# EAGLE design ASBS_radio_v1_1 (EAGLE 5.11)
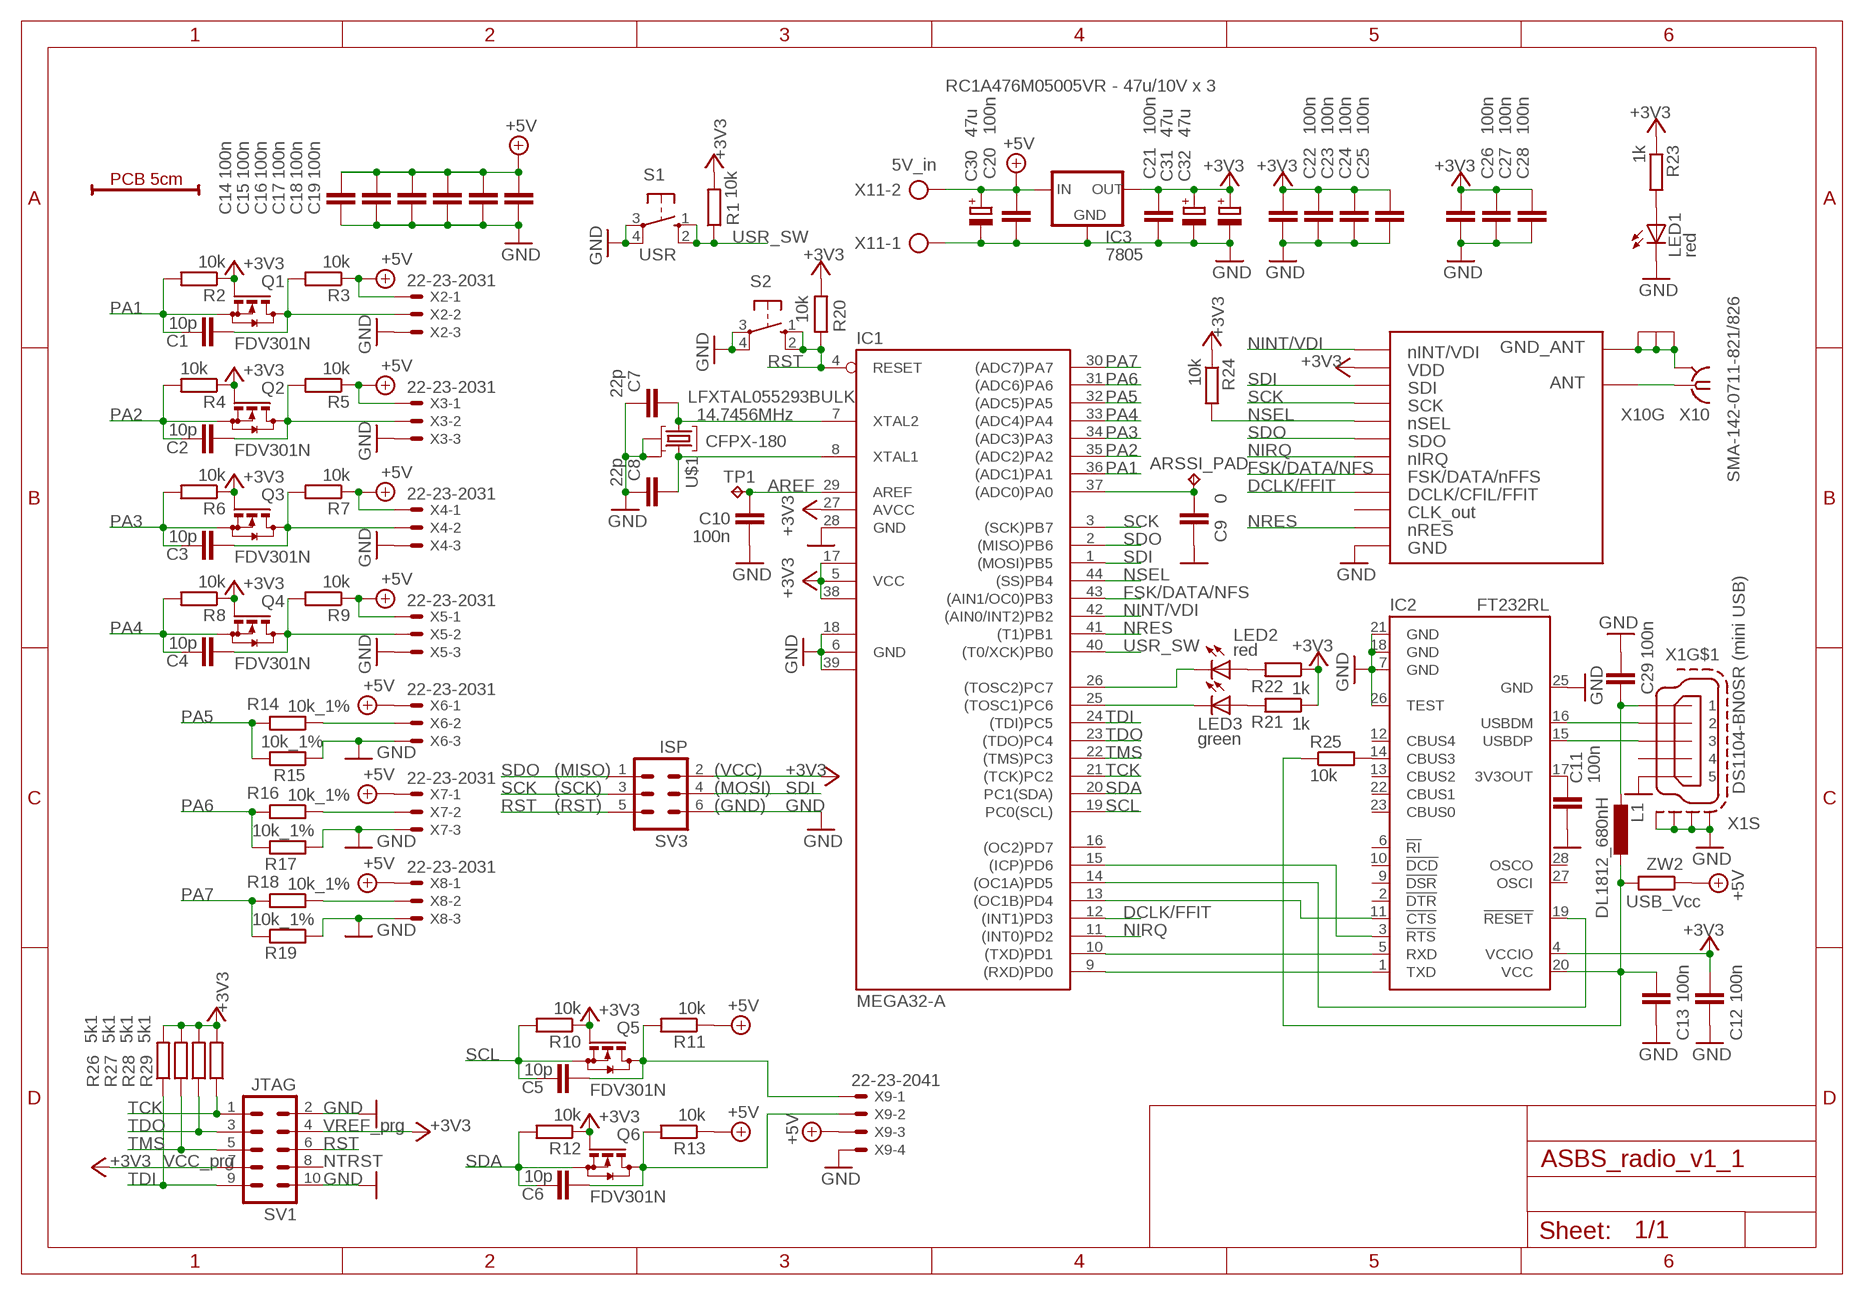
[diagram p0: schematic, sheet 1]

## Parts
ARSSI_PAD  TPPAD1-13  [P1-13]
C1  10p  C-EUC0603K  [C0603K]
C2  10p  C-EUC0603K  [C0603K]
C3  10p  C-EUC0603K  [C0603K]
C4  10p  C-EUC0603K  [C0603K]
C5  10p  C-EUC0603K  [C0603K]
C6  10p  C-EUC0603K  [C0603K]
C7  22p  C-EUC0603K  [C0603K]
C8  22p  C-EUC0603K  [C0603K]
C9  0  C-EUC0805  [C0805]
C10  100n  C-EUC0805  [C0805]
C11  100n  C-EUC0805  [C0805]
C12  100n  C-EUC0805  [C0805]
C13  100n  C-EUC0805  [C0805]
C14  100n  C-EUC0805  [C0805]
C15  100n  C-EUC0805  [C0805]
C16  100n  C-EUC0805  [C0805]
C17  100n  C-EUC0805  [C0805]
C18  100n  C-EUC0805  [C0805]
C19  100n  C-EUC0805  [C0805]
C20  100n  C-EUC0805  [C0805]
C21  100n  C-EUC0805  [C0805]
C22  100n  C-EUC0805  [C0805]
C23  100n  C-EUC0805  [C0805]
C24  100n  C-EUC0805  [C0805]
C25  100n  C-EUC0805  [C0805]
C26  100n  C-EUC0805  [C0805]
C27  100n  C-EUC0805  [C0805]
C28  100n  C-EUC0805  [C0805]
C29  100n  C-EUC0805  [C0805]
C30  47u  CPOL-EU153CLV-0505  [153CLV-0505]
C31  47u  CPOL-EU153CLV-0505  [153CLV-0505]
C32  47u  CPOL-EU153CLV-0505  [153CLV-0505]
IC1  MEGA32-A  [TQFP44]
IC2  FT232RL  [SSOP28]
IC3  7805  78XXS  [78XXS]
L1  DL1812_680nH  L-EUL4516C  [L4516C]
LED1  red  LEDCHIP-LED0805  [CHIP-LED0805]
LED2  red  LEDCHIP-LED0805  [CHIP-LED0805]
LED3  green  LEDCHIP-LED0805  [CHIP-LED0805]
Q1  FDV301N  BSS123  [SOT23]
Q2  FDV301N  BSS123  [SOT23]
Q3  FDV301N  BSS123  [SOT23]
Q4  FDV301N  BSS123  [SOT23]
Q5  FDV301N  BSS123  [SOT23]
Q6  FDV301N  BSS123  [SOT23]
R1  10k  R-EU_R0603  [R0603]
R2  10k  R-EU_R0603  [R0603]
R3  10k  R-EU_R0603  [R0603]
R4  10k  R-EU_R0603  [R0603]
R5  10k  R-EU_R0603  [R0603]
R6  10k  R-EU_R0603  [R0603]
R7  10k  R-EU_R0603  [R0603]
R8  10k  R-EU_R0603  [R0603]
R9  10k  R-EU_R0603  [R0603]
R10  10k  R-EU_R0603  [R0603]
R11  10k  R-EU_R0603  [R0603]
R12  10k  R-EU_R0603  [R0603]
R13  10k  R-EU_R0603  [R0603]
R14  10k_1%  R-EU_R0603  [R0603]
R15  10k_1%  R-EU_R0603  [R0603]
R16  10k_1%  R-EU_R0603  [R0603]
R17  10k_1%  R-EU_R0603  [R0603]
R18  10k_1%  R-EU_R0603  [R0603]
R19  10k_1%  R-EU_R0603  [R0603]
R20  10k  R-EU_R0603  [R0603]
R21  1k  R-EU_R0603  [R0603]
R22  1k  R-EU_R0603  [R0603]
R23  1k  R-EU_R0603  [R0603]
R24  10k  R-EU_R0603  [R0603]
R25  10k  R-EU_R0603  [R0603]
R26  5k1  R-EU_R0603  [R0603]
R27  5k1  R-EU_R0603  [R0603]
R28  5k1  R-EU_R0603  [R0603]
R29  5k1  R-EU_R0603  [R0603]
S1  USR  10-XX  [B3F-10XX]
S2  RST  10-XX  [B3F-10XX]
SV1  JTAG  MA05-2  [MA05-2]
SV3  ISP  MA03-2  [MA03-2]
TP1  TPPAD1-13  [P1-13]
U$1  CFPX-180  [CFPX-180]
U$2  RFM12BS  [RFM12B_RF_SMD]
U$3  SCALE_5CM  [SCALE_5CM]
X1  DS1104-BN0SR (mini USB)  MINI-USB-SCHIELD-32005-201  [32005-201]
X2  22-23-2031  [22-23-2031]
X3  22-23-2031  [22-23-2031]
X4  22-23-2031  [22-23-2031]
X5  22-23-2031  [22-23-2031]
X6  22-23-2031  [22-23-2031]
X7  22-23-2031  [22-23-2031]
X8  22-23-2031  [22-23-2031]
X9  22-23-2041  [22-23-2041]
X10  SMA-142-0711-821/826  [J502-ND-142-0711-821/826]
X11  5V_in  AK500/2  [AK500/2]
ZW2  USB_Vcc  R-EU_R0603  [R0603]

## Nets
+3V3: C12.2 C21.1 C22.1 C23.1 C24.1 C25.1 C26.1 C27.1 C28.1 C31.+ C32.+ IC1.5(VCC) IC1.17(VCC1) IC1.27(AVCC) IC1.38(VCC2) IC2.4(VCCIO) IC3.OUT Q1.1(G) Q2.1(G) Q3.1(G) Q4.1(G) Q5.1(G) Q6.1(G) R1.2 R2.1 R4.1 R6.1 R8.1 R10.1 R12.1 R20.2 R21.1 R22.1 R23.1 R24.1 R26.2 R27.2 R28.2 R29.2 SV1.4 SV1.7 SV3.2 U$2.P$2
+5V: C14.1 C15.1 C16.1 C17.1 C18.1 C19.1 C20.1 C30.+ IC3.IN R3.1 R5.1 R7.1 R9.1 R11.1 R13.1 X2.1 X3.1 X4.1 X5.1 X6.1 X7.1 X8.1 X9.3 X11.2 ZW2.1
AREF: C10.2 IC1.29(AREF) TP1.TP
ARSSI: ARSSI_PAD.TP C9.2 IC1.37((ADC0)PA0)
DCLK/FFIT: IC1.12((INT1)PD3) U$2.P$9
FSK/DATA/NFS: IC1.43((AIN1/OC0)PB3) U$2.P$8
GND: C7.1 C8.1 C9.1 C10.1 C11.2 C12.1 C13.1 C14.2 C15.2 C16.2 C17.2 C18.2 C19.2 C20.2 C21.2 C22.2 C23.2 C24.2 C25.2 C26.2 C27.2 C28.2 C29.1 C30.- C31.- C32.- IC1.6(GND) IC1.18(GND1) IC1.28(GND) IC1.39(GND2) IC2.7(GND) IC2.18(GND) IC2.21(GND) IC2.25(GND) IC2.26(TEST) IC3.GND LED1.C R15.1 R17.1 R19.1 S1.3(P) S1.4(P1) S2.3(P) S2.4(P1) SV1.2 SV1.10 SV3.6 U$1.P$2 U$1.P$4 U$2.P$12 X1.5 X1.M1(S:S1) X1.M2(S:S2) X1.M3(S:S3) X1.M4(S:S4) X2.3 X3.3 X4.3 X5.3 X6.3 X7.3 X8.3 X9.4 X11.1
N$1: IC1.13((OC1B)PD4) IC2.11(!CTS)
N$2: IC1.14((OC1A)PD5) IC2.19(!RESET)
N$3: IC1.15((ICP)PD6) IC2.3(!RTS)
N$4: C2.2 Q2.3(D) R5.2 X3.2
N$5: C8.2 IC1.8(XTAL1) U$1.P$3
N$6: C7.2 IC1.7(XTAL2) U$1.P$1
N$7: IC2.14(CBUS3) R25.2
N$8: C3.2 Q3.3(D) R7.2 X4.2
N$9: C1.2 Q1.3(D) R3.2 X2.2
N$10: C4.2 Q4.3(D) R9.2 X5.2
N$11: U$2.P$13 X10.1
N$12: R14.1 X6.2
N$13: R16.1 X7.2
N$14: IC1.26((TOSC2)PC7) LED2.C
N$15: IC1.9((RXD)PD0) IC2.1(TXD)
N$16: IC1.10((TXD)PD1) IC2.5(RXD)
N$17: IC1.25((TOSC1)PC6) LED3.C
N$18: LED3.A R21.2
N$19: LED2.A R22.2
N$20: R18.1 X8.2
N$21: LED1.A R23.2
N$22: C5.2 Q5.3(D) R11.2 X9.1
N$23: C6.2 Q6.3(D) R13.2 X9.2
N$39: C13.2 IC2.20(VCC) L1.1 R25.1 ZW2.2
N$43: C29.2 L1.2 X1.1
N$44: IC2.16(USBDM) X1.2
N$45: IC2.15(USBDP) X1.3
N$46: C11.1 IC2.17(3V3OUT)
NINT/VDI: IC1.42((AIN0/INT2)PB2) U$2.P$1
NIRQ: IC1.11((INT0)PD2) U$2.P$7
NRES: IC1.41((T1)PB1) U$2.P$11
NSEL: IC1.44((SS)PB4) R24.2 U$2.P$5
PA1: C1.1 IC1.36((ADC1)PA1) Q1.2(S) R2.2
PA2: C2.1 IC1.35((ADC2)PA2) Q2.2(S) R4.2
PA3: C3.1 IC1.34((ADC3)PA3) Q3.2(S) R6.2
PA4: C4.1 IC1.33((ADC4)PA4) Q4.2(S) R8.2
PA5: IC1.32((ADC5)PA5) R14.2 R15.2
PA6: IC1.31((ADC6)PA6) R16.2 R17.2
PA7: IC1.30((ADC7)PA7) R18.2 R19.2
RGND: U$2.P$14 X10.G@1(GND) X10.G@2(GND) X10.G@3(GND) X10.G@4(GND)
RST: IC1.4(RESET) R20.1 S2.1(S) S2.2(S1) SV1.6 SV3.5
SCK: IC1.3((SCK)PB7) SV3.3 U$2.P$4
SCL: C5.1 IC1.19(PC0(SCL)) Q5.2(S) R10.2
SDA: C6.1 IC1.20(PC1(SDA)) Q6.2(S) R12.2
SDI: IC1.1((MOSI)PB5) SV3.4 U$2.P$3
SDO: IC1.2((MISO)PB6) SV3.1 U$2.P$6
TCK: IC1.21((TCK)PC2) R29.1 SV1.1
TDI: IC1.24((TDI)PC5) R26.1 SV1.9
TDO: IC1.23((TDO)PC4) R28.1 SV1.3
TMS: IC1.22((TMS)PC3) R27.1 SV1.5
USR_SW: IC1.40((T0/XCK)PB0) R1.1 S1.1(S) S1.2(S1)
Unconnected: IC1.16((OC2)PD7) IC2.2(!DTR) IC2.6(!RI) IC2.9(!DSR) IC2.10(!DCD) IC2.12(CBUS4) IC2.13(CBUS2) IC2.22(CBUS1) IC2.23(CBUS0) IC2.27(OSCI) IC2.28(OSCO) SV1.8 U$2.P$10 X1.4

## Notes on the sheet
- RC1A476M05005VR - 47u/10V x 3
- LFXTAL055293BULK
- 14.7456MHz
- (MISO) | (VCC)
- (SCK) | (MOSI)
- (RST) | (GND)
- GND
- VREF_prg
- VCC_prg | NTRST
- GND

## Library data of the parts
ARSSI_PAD TP1 = testpad:TP: Test pad
C1-C6 C9-C29 = rcl:C-EU: CAPACITOR, European symbol
C7 C8 = resistor:C-EU: CAPACITOR, European symbol
C30-C32 = rcl:CPOL-EU: POLARIZED CAPACITOR, European symbol
IC1 = atmel:MEGA32: MICROCONTROLLER 32 Kbytes FLASH 2 Kbytes SRAM 1 Kbytes EEPROM USART 8-channel 10 bit ADC Source: www.atmel.com .. doc2503.pdf; MPN: ATMEGA32-16AU; OC_FARNELL: 9171274; OC_NEWARK: 69K6677
IC2 = ftdichip:FT232R: Source: http://www.ftdichip.com/Documents/DataSheets/DS_FT232R_v104.pdf; MPN: FT232RL; OC_FARNELL: 1146032; OC_NEWARK: 91K9918
IC3 = v-reg:78XXS: VOLTAGE REGULATOR
L1 = rcl:L-EU: INDUCTOR, European symbol
LED1-LED3 = led:LED: LED OSRAM: - CHIPLED LG R971, LG N971, LY N971, LG Q971, LY Q971, LO R971, LY R971 LH N974, LH R974 LS Q976, LO Q976, LY Q976 LO Q996 - Hyper CHIPLED LW Q18S LB Q993, LB Q99A, LB R99A - SideLED LS A670, LO A670, LY A670, LG A670, LP A670 LB A673, LV A673, LT A673, LW A673 LH A674 LY A675 LS A676, LA A676, LO A676, LY A676, LW A676 LS A679, LY A679, LG A679 - Hyper Micro SIDELED® LS Y876, LA Y876, LO Y876, LY Y876 LT Y87S - SmartLED LW L88C, LW L88S LB L89C, LB L89S, LG L890 LS L89K, LO L89K, LY L89K LS L896, LA L896, LO L896, LY L896 - TOPLED LS T670, LO T670, LY T670, LG T670, LP T670 LSG T670, LSP T670, LSY T670, LOP T670, LYG T670 LG T671, LOG T671, LSG T671 LB T673, LV T673, LT T673, LW T673 LH T674 LS T676, LA T676, LO T676, LY T676, LB T676, LH T676, LSB T676, LW T676 LB T67C, LV T67C, LT T67C, LS T67K, LO T67K, LY T67K, LW E67C LS E67B, LA E67B, LO E67B, LY E67B, LB E67C, LV E67C, LT E67C LW T67C LS T679, LY T679, LG T679 LS T770, LO T770, LY T770, LG T770, LP T770 LB T773, LV T773, LT T773, LW T773 LH T774 LS E675, LA E675, LY E675, LS T675 LS T776, LA T776, LO T776, LY T776, LB T776 LHGB T686 LT T68C, LB T68C - Hyper Mini TOPLED® LB M676 - Mini TOPLED Santana® LG M470 LS M47K, LO M47K, LY M47K Source: http://www.osram.convergy.de LUXEON: - LUMILED® LXK2-PW12-R00, LXK2-PW12-S00, LXK2-PW14-U00, LXK2-PW14-V00 LXK2-PM12-R00, LXK2-PM12-S00, LXK2-PM14-U00 LXK2-PE12-Q00, LXK2-PE12-R00, LXK2-PE12-S00, LXK2-PE14-T00, LXK2-PE14-U00 LXK2-PB12-K00, LXK2-PB12-L00, LXK2-PB12-M00, LXK2-PB14-N00, LXK2-PB14-P00, LXK2-PB14-Q00 LXK2-PR12-L00, LXK2-PR12-M00, LXK2-PR14-Q00, LXK2-PR14-R00 LXK2-PD12-Q00, LXK2-PD12-R00, LXK2-PD12-S00 LXK2-PH12-R00, LXK2-PH12-S00 LXK2-PL12-P00, LXK2-PL12-Q00, LXK2-PL12-R00 Source: www.luxeon.com KINGBRIGHT: KA-3528ASYC Source: www.kingbright.com
Q1-Q6 = transistor-small-signal:BSS123: N-CHANNEL MOS FET
R1-R29 ZW2 = resistor:R-EU_: RESISTOR, European symbol
S1 S2 = switch-omron:10-XX: OMRON SWITCH; MPN: B3F-1000; OC_FARNELL: 176432; OC_NEWARK: 36M3542
SV1 = con-lstb:MA05-2: PIN HEADER; OC_FARNELL: unknown; OC_NEWARK: unknown
SV3 = con-lstb:MA03-2: PIN HEADER; OC_FARNELL: unknown; OC_NEWARK: unknown
U$1 = crystal_frequency_products:CFPX-180
U$2 = RFM12B:RFM12B
U$3 = scale:SCALE_5CM
X1 = con-cypressindustries:MINI-USB-SCHIELD-: MINI USB-B Conector Source: www.cypressindustries.com; OC_FARNELL: unknown; OC_NEWARK: unknown
X2-X8 = con-molex:22-23-2031: .100" (2.54mm) Center Header - 3 Pin; MF: MOLEX; MPN: 22-23-2031; OC_FARNELL: 1462950; OC_NEWARK: 30C0862
X9 = con-molex:22-23-2041: .100" (2.54mm) Center Header - 4 Pin; MF: MOLEX; MPN: 22-23-2041; OC_FARNELL: 1462920; OC_NEWARK: 38C0355
X10 = con-coax:SMA-: SMA 50 Ohm End Launch Jack Receptacle - Round Contact Johnson Components Source: www.johnsoncomponents.com .. J502-ND.pdf; MF: JOHNSON COMPONENTS; MPN: 142-0711-821; OC_FARNELL: 1019328; OC_NEWARK: 16F3627
X11 = con-ptr500:AK500/2: CONNECTOR; OC_FARNELL: unknown; OC_NEWARK: unknown

## Board
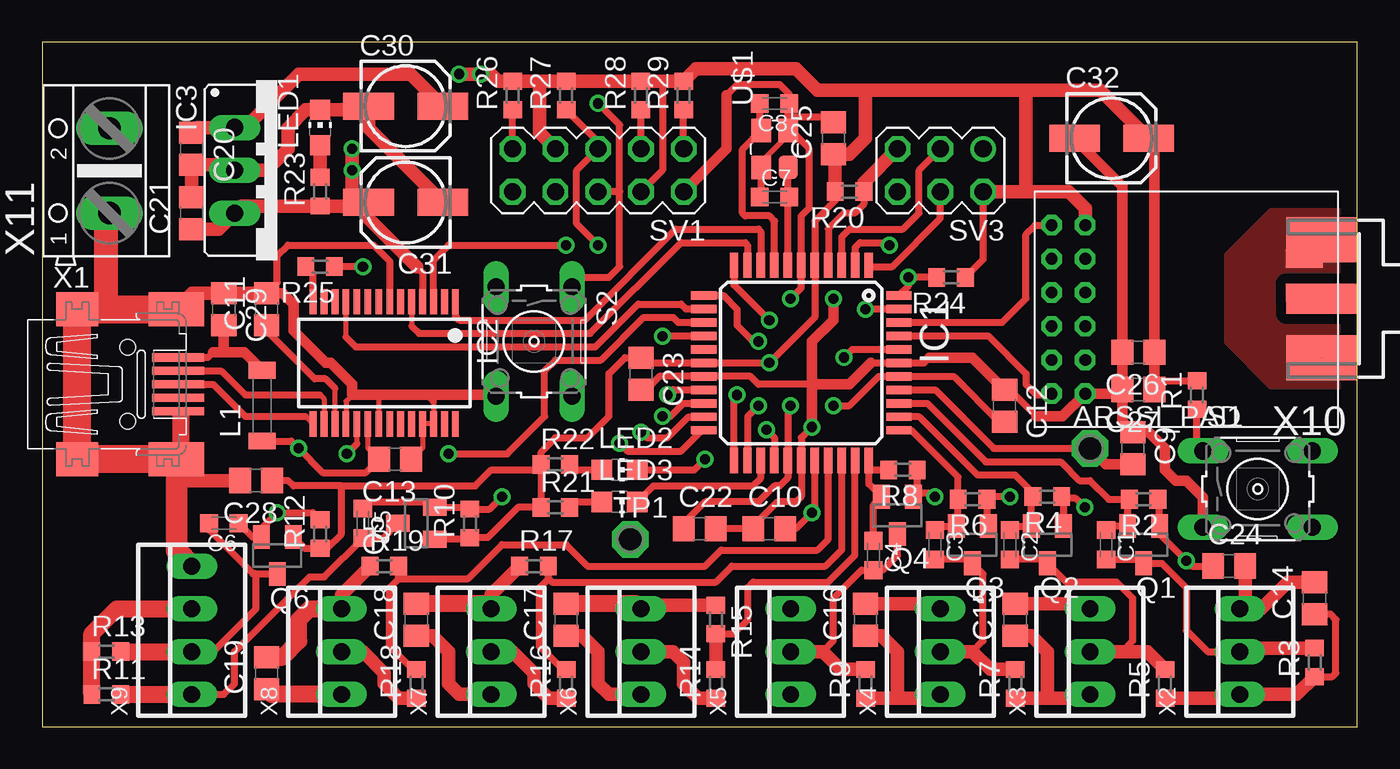
[diagram p1: board, top side]
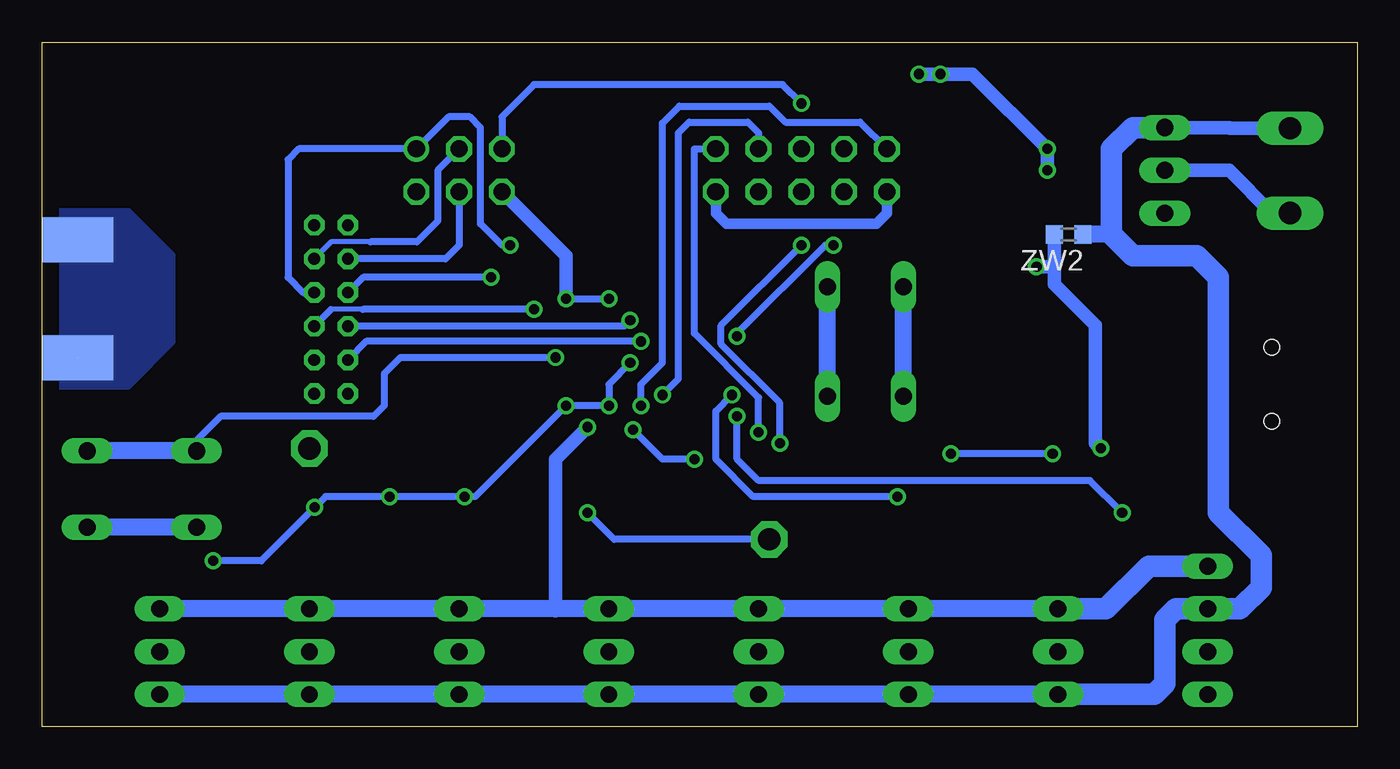
[diagram p2: board, bottom side, seen from below]

Size 78.11 x 40.63 mm. Coordinates in mm from the lower left corner, seen from the top.
Outline: 0,0 78.11,0 78.11,40.63 0,40.63 0,0
Copper layers (1*16): Top 0.035mm / dielectric 1.5mm / Bottom 0.035mm
Design rules "default *": minimum track width 10mil, minimum drill 0.4mm, track to track 9mil, track to pad 9mil, pad to pad 9mil, via to via 9mil, smd to smd 8mil, copper to edge 40mil, drill to drill 8mil, minimum pad ring 10mil, minimum via ring 8mil, stop-mask expansion 4mil, vias tented up to drill 0mil, thermal gap 10mil

### Footprints (pad centres in the part's own frame; a part is rotated, then mirrored left to right if it is on the bottom)
P1-13 = drill 1.321 pad 2.159 octagon: TP 0,0
C0603K = smd 1.05 x 1.08: 1 -0.875,0; 2 0.875,0
C0805 = smd 1.3 x 1.5: 1 -0.95,0; 2 0.95,0
153CLV-0505 = smd 3 x 1.6: + 2.2,0; - -2.2,0
TQFP44 = smd 1.5 x 0.5: 1 -5.8,4; 2 -5.8,3.2; 3 -5.8,2.4; 4 -5.8,1.6; 5 -5.8,0.8; 6 -5.8,0; 7 -5.8,-0.8; 8 -5.8,-1.6; 9 -5.8,-2.4; 10 -5.8,-3.2; 11 -5.8,-4; 23 5.8,-4; 24 5.8,-3.2; 25 5.8,-2.4; 26 5.8,-1.6; 27 5.8,-0.8; 28 5.8,0; 29 5.8,0.8; 30 5.8,1.6; 31 5.8,2.4; 32 5.8,3.2; 33 5.8,4 | smd 0.5 x 1.5: 12 -4,-5.8; 13 -3.2,-5.8; 14 -2.4,-5.8; 15 -1.6,-5.8; 16 -0.8,-5.8; 17 0,-5.8; 18 0.8,-5.8; 19 1.6,-5.8; 20 2.4,-5.8; 21 3.2,-5.8; 22 4,-5.8; 34 4,5.8; 35 3.2,5.8; 36 2.4,5.8; 37 1.6,5.8; 38 0.8,5.8; 39 0,5.8; 40 -0.8,5.8; 41 -1.6,5.8; 42 -2.4,5.8; 43 -3.2,5.8; 44 -4,5.8
SSOP28 = smd 0.4 x 1.5: 1 -4.225,-3.625; 2 -3.575,-3.625; 3 -2.925,-3.625; 4 -2.275,-3.625; 5 -1.625,-3.625; 6 -0.975,-3.625; 7 -0.325,-3.625; 8 0.325,-3.625; 9 0.975,-3.625; 10 1.625,-3.625; 11 2.275,-3.625; 12 2.925,-3.625; 13 3.575,-3.625; 14 4.225,-3.625; 15 4.225,3.625; 16 3.575,3.625; 17 2.925,3.625; 18 2.275,3.625; 19 1.625,3.625; 20 0.975,3.625; 21 0.325,3.625; 22 -0.325,3.625; 23 -0.975,3.625; 24 -1.625,3.625; 25 -2.275,3.625; 26 -2.925,3.625; 27 -3.575,3.625; 28 -4.225,3.625
78XXS = drill 1.016 long: GND 0,-2.54; IN -2.54,-2.54; OUT 2.54,-2.54
L4516C = smd 1 x 1.6: 1 -2.1,0; 2 2.1,0
CHIP-LED0805 = smd 1.2 x 1.2: A 0,-1.05; C 0,1.05
SOT23 = smd 1 x 1.4: 1 -0.95,-1.1; 2 0.95,-1.1; 3 0,1.1
R0603 = smd 1 x 1.1: 1 -0.85,0; 2 0.85,0
B3F-10XX = drill 1.016 long: 1 -3.251,2.261; 2 3.251,2.261; 3 -3.251,-2.261; 4 3.251,-2.261
MA05-2 = drill 1.016 octagon: 1 -5.08,-1.27; 2 -5.08,1.27; 3 -2.54,-1.27; 4 -2.54,1.27; 5 0,-1.27; 6 0,1.27; 7 2.54,-1.27; 8 2.54,1.27; 9 5.08,-1.27; 10 5.08,1.27
MA03-2 = drill 1.016 round: 1 -2.54,-1.27 | drill 1.016 octagon: 2 -2.54,1.27; 3 0,-1.27; 4 0,1.27; 5 2.54,-1.27; 6 2.54,1.27
CFPX-180 = smd 1.4 x 1.15: P$1 -1.1,-0.8; P$2 1.1,-0.8; P$3 1.1,0.8; P$4 -1.1,0.8
RFM12B_RF_SMD = drill 0.7 octagon: P$1 -8,5; P$2 -6,5; P$3 -8,3; P$4 -6,3; P$5 -8,1; P$6 -6,1; P$7 -8,-1; P$8 -6,-1; P$9 -8,-3; P$10 -6,-3; P$11 -8,-5; P$12 -6,-5 | smd 2.184 x 1.067: P$13 7,1; P$14 7,3
32005-201 = smd 3.1 x 0.5: 1 3,1.6; 2 3,0.8; 3 3,0; 4 3,-0.8; 5 3,-1.6 | smd 2.5 x 2: M1 -3,-4.45; M2 -3,4.45 | smd 3.3 x 2: M3 2.9,4.45; M4 2.9,-4.45 | hole 0.9: 0,2.2; 0,-2.2
22-23-2031 = drill 1 long: 1 -2.54,0; 2 0,0; 3 2.54,0
22-23-2041 = drill 1 long: 1 -3.81,0; 2 -1.27,0; 3 1.27,0; 4 3.81,0
J502-ND-142-0711-821/826 = smd 4.191 x 1.778: 1 2.115,0 | smd 4.191 x 2.667: G@1 2.115,3.495; G@2 2.115,-3.495 | smd 4.191 x 2.667 bottom: G@3 2.115,3.495; G@4 2.115,-3.495
AK500/2 = drill 1.321 long: 1 -2.515,0; 2 2.515,0

### Placement (x,y rotation side)
ARSSI_PAD  62.23,16.51 0 top
C1  63.18,10.79 270 top
C2  57.47,10.79 270 top
C3  53.02,10.79 270 top
C4  49.37,10.16 270 top
C5  19.05,12.06 270 top
C6  10.79,12.06 180 top
C7  43.5,31.43 0 top
C8  43.5,36.99 180 top
C9  64.77,16.51 270 top
C10  43.18,11.75 0 top
C11  13.34,24.77 90 top
C12  57.15,19.05 270 top
C13  20.95,15.88 180 top
C14  75.56,7.62 90 top
C15  57.78,6.35 90 top
C16  48.9,6.35 90 top
C17  31.11,6.35 90 top
C18  22.23,6.35 90 top
C19  13.34,3.17 90 top
C20  8.89,34.29 270 top
C21  8.89,30.48 90 top
C22  39.05,11.75 0 top
C23  35.56,20.95 270 top
C24  70.48,9.53 0 top
C25  46.99,34.92 90 top
C26  65.09,22.23 180 top
C27  65.09,20 180 top
C28  12.7,14.61 180 top
C29  10.79,24.77 270 top
C30  21.59,36.83 0 top
C31  21.59,31.11 180 top
C32  63.5,34.92 0 top
IC1  45.09,21.59 270 top
IC2  20.32,21.59 180 top
IC3  13.97,33.02 270 top
L1  13.06,19.05 90 top
LED1  16.51,35.56 0 top
LED2  34.29,15.24 270 top
LED3  34.29,13.34 270 top
Q1  65.41,10.79 180 top
Q2  59.69,10.79 180 top
Q3  55.24,10.79 180 top
Q4  50.8,12.54 180 top
Q5  22.23,12.06 90 top
Q6  13.97,10.16 180 top
R1  68.58,19.68 90 top
R2  65.41,13.49 180 top
R3  75.56,3.81 90 top
R4  59.69,13.65 180 top
R5  66.67,2.54 90 top
R6  55.24,13.49 180 top
R7  57.78,2.54 90 top
R8  51.12,15.24 180 top
R9  48.9,2.54 90 top
R10  25.4,12.06 90 top
R11  3.81,1.91 0 top
R12  16.51,11.43 90 top
R13  3.81,4.45 0 top
R14  40.01,2.54 90 top
R15  40.01,6.35 270 top
R16  31.11,2.54 90 top
R17  29.21,9.53 0 top
R18  22.23,2.54 90 top
R19  20.32,9.53 0 top
R20  47.94,31.75 180 top
R21  30.48,13.02 0 top
R22  30.48,15.56 0 top
R23  16.51,31.75 90 top
R24  53.98,26.67 180 top
R25  16.51,27.3 180 top
R26  27.94,37.47 90 top
R27  31.11,37.47 90 top
R28  35.56,37.47 90 top
R29  38.1,37.47 90 top
S1  72.19,14.1 0 top
S2  29.21,22.86 270 top
SV1  33.02,33.02 180 top
SV3  53.34,33.02 180 top
TP1  34.92,11.11 0 top
U$1  43.5,34.29 90 top
U$2  67.94,24.77 0 top
U$3  25.4,45.72 180 top  (outside the outline)
X1  5.08,20.32 0 top
X2  71.12,4.45 90 top
X3  62.23,4.45 90 top
X4  53.34,4.45 90 top
X5  44.45,4.45 90 top
X6  35.56,4.45 90 top
X7  26.67,4.45 90 top
X8  17.78,4.45 90 top
X9  8.89,5.71 90 top
X10  78.11,25.4 180 top
X11  4,33 90 top
ZW2  17.14,29.21 180 bottom

### Tracks (layer width: path | path; a pad name or v marks a point on that pad's centre or on a via)
+3V3  (via drill 0.6, 0.6 pad 0.3, 0.6 pad 0.61)
  Top 0.406: R22.1 R21.1 28.26,13.02 26.45,11.21 R10.1 25.3,11.12 Q5.1 | C25.1 47.09,33.87 | C22.1 38.1,12.07 39.37,13.34 42.55,13.34 43.5,14.29 43.81,14.29 44.28,14.76 IC1.27 44.28,18.89 v44.45,19.05 | 46.99,31.85 R20.2 47.09,31.22 45.88,30.01 IC1.5 45.88,24.3 v43.18,21.59 IC1.17 35.88,21.59 C23.1 34.6,21.91 33.66,20.95 33.66,18.41 32.38,17.14 30.48,17.14 29.63,16.3 R22.1 | SV1.4 36.83,33.02 36.83,38.31 | IC2.4 22.59,26.93 22.23,27.3 | R1.2 66.57,20.54 C27.1 | R2.1 66.36,13.39 Q1.1 66.36,11.43 v67.94,9.84 68.26,9.53 C24.1 | 60.64,13.55 Q2.1 | 60.64,13.55 R4.1 | Q3.1 56.09,11.99 R6.1 56.25,13.65 v57.47,13.65 | 51.97,13.86 R8.1 | 51.97,13.86 Q4.1 | 51.97,13.86 52.82,13.86 v53.02,13.65 | 60.64,13.55 61.38,13.55 v61.91,13.02 | v46.99,19.05 47.94,19.05 49.68,20.79 IC1.38 54.14,20.79 56.83,18.1 C12.2 | Q6.1 15.6,10.58 R12.1 16.93,10.58 17.78,11.43 17.78,14.29 | C28.1 14.61,14.61 14.92,14.29 17.78,14.29 | R22.1 29.31,15.24 26.67,15.24 25.72,14.29 17.78,14.29 | R24.1 55.88,27.73 SV3.2
  Top 0.61: C27.1 C26.1 66.04,34.59 C32.+ 63.8,36.83
  Top 0.813: 47.09,33.87 R20.2 | C21.1 10.48,29.53 IC3.OUT 11.85,30.9 R23.1 18.41,30.9 | 29.53,38.31 R26.2 27.09,38.31 26.67,38.73 v26.04,38.73 v24.77,38.73 | 29.53,38.31 R27.2 R28.2 36.83,38.31 R29.2 38.84,39.05 44.77,39.05 46.04,37.78 48.9,37.78 | SV1.7 29.53,35.24 29.53,38.31 | 22.23,27.3 19.39,30.14 C31.+ 19.18,30.9 18.41,30.9 | 48.9,37.78 58.42,37.78 | 58.42,37.78 62.84,37.78 C32.+ | C25.1 47.95,33.98 48.9,34.92 48.9,37.78 | 58.42,31.75 SV3.2 | 58.42,37.78 58.42,31.75 | U$2.P$2 61.95,30.77 60.96,31.75 58.42,31.75 | v18.41,34.29 v18.41,33.02 18.41,30.9
  Bottom 0.406: v43.18,21.59 44.45,20.32 v44.45,19.05 v46.99,19.05 52.39,13.65 v53.02,13.65 v57.47,13.65 61.28,13.65 v61.91,13.02 65.09,9.84 v67.94,9.84
  Bottom 0.813: v26.04,38.73 v24.77,38.73 22.86,38.73 v18.41,34.29 v18.41,33.02
+5V
  Top 0.406: C14.1 76.52,6.67 76.83,6.35 76.83,3.17 76.62,2.96 R3.1
  Top 0.813: C20.1 9.21,35.56 IC3.IN 12.06,35.56 15.24,38.73 21.89,38.73 C30.+ | R3.1 74.51,1.91 X2.1 70.91,1.69 R5.1 | X3.1 62.02,1.69 59.48,1.69 | C15.1 58.73,5.4 59.69,4.45 59.69,1.91 59.48,1.69 | 59.48,1.69 R7.1 | 50.8,1.69 53.12,1.69 X4.1 | 50.8,1.69 R9.1 | C16.1 49.84,5.4 50.8,4.45 50.8,1.69 | C17.1 32.06,5.4 33.02,4.45 33.02,2.54 33.66,1.91 X6.1 | C18.1 23.18,5.4 24.13,4.45 24.13,2.54 24.77,1.91 X7.1
  Top 1.016: C19.1 13.65,1.91 X8.1 | R11.1 R13.1 2.96,5.5 4.45,6.99 X9.3
  Bottom 0.813: IC3.IN 7.62,35.56 7.58,35.52 X11.2
  Bottom 1.016: X8.1 X7.1 X6.1 X5.1 X4.1 X3.1 X2.1 | 14.61,29.21 ZW2.1
  Bottom 1.27: X8.1 12.06,1.91 11.43,2.54 11.43,6.35 10.79,6.99 X9.3 | X9.3 6.99,6.99 5.71,8.26 5.71,10.16 8.26,12.7 8.26,26.67 9.53,27.94 13.34,27.94 14.61,29.21 14.61,34.29 13.34,35.56 IC3.IN | X9.3 9.53,6.99
AREF  (via drill 0.6)
  Top 0.406: IC1.29 45.88,12.87 v45.72,12.7 44.77,11.75 C10.2
  Bottom 0.406: TP1.TP 44.13,11.11 v45.72,12.7
ARSSI
  Top 0.406: IC1.37 53.03,19.99 56.52,16.51 ARSSI_PAD.TP
  Top 0.61: ARSSI_PAD.TP 63.18,15.56 C9.2
DCLK/FFIT  (via drill 0.6)
  Top 0.406: v42.55,22.86 42.23,22.86 41.27,23.81 41.27,24.77 40.45,25.59 IC1.12
  Bottom 0.406: U$2.P$9 58.85,22.86 v42.55,22.86
FSK/DATA/NFS  (via drill 0.6)
  Top 0.406: v48.9,24.77 48.92,24.79 IC1.43
  Bottom 0.305: 59.05,24.77 60.96,24.77
  Bottom 0.406: U$2.P$8 60.96,24.75 60.96,24.77 | v48.9,24.77 59.05,24.77
GND  (via drill 0.6)
  Top 0.305: IC2.18 18.05,19.32 18.41,19.68 | 23.25,19.3 IC2.26 IC2.25 22.59,16.57 C13.1 | 20,19.68 IC2.21 | 44.3,35.09 42.7,33.49
  Top 0.406: 8.26,18.41 8.08,18.59 X1.5 | 22.86,19.68 23.25,19.3 | v44.45,25.4 45.09,26.04 IC1.6 45.09,30.32 45.56,30.8 45.56,34.29 44.46,35.39 U$1.P$2 | U$1.P$2 44.62,35.39 | U$1.P$2 44.3,36.2 | 44.3,36.2 44.3,36.91 C8.1 44.37,37.54 43.81,38.1 41.27,38.1 40.64,37.47 | 42.7,33.49 U$1.P$4 42.7,31.51 C7.1 | U$1.P$2 44.3,35.09 | C25.2 46.67,36.2 44.3,36.2 | C22.2 C10.1 42.23,11.91 43.66,13.34 44.77,13.34 45.09,13.65 IC1.28 45.09,17.14 v45.72,17.78 | 45.72,20.32 42.55,20.32 42.08,20.79 IC1.18 36.66,20.79 35.88,20 C23.2 | 52.7,21.91 52.39,21.59 IC1.39 49.21,21.59 | 63.9,19.77 arc90 C27.2 | IC2.7 20.64,27.61 19.68,28.57 14.61,28.57 13.97,27.94 13.97,26.35 C11.2 | 59.05,18.41 57.47,20 C12.1
  Top 0.61: C11.2 14.29,25.71 14.92,25.08 14.92,23.5 16.83,21.59 17.14,21.59 18.41,20.32 18.41,19.68 20,19.68 22.86,19.68 26.87,19.68 S2.4 | SV1.2 40.64,34.29 40.64,37.47 | C32.- 64.14,32.09 C26.2 C27.2 64.14,18.09 C9.1 65.72,17.46 66.67,16.51 66.67,15.24 67.31,14.61 67.94,14.61 68.93,13.62 S1.3 | v45.72,17.78 45.72,20.32 | 49.21,21.59 47.94,20.32 45.72,20.32 | v46.99,25.4 46.99,24.13 45.72,22.86 45.72,20.32 | 52.7,21.91 55.24,21.91 C12.1 | 59.05,18.41 60.59,18.41 U$2.P$12 63.9,19.77
  Top 0.813: X1.M3 8.93,25.71 C29.1 C11.2 | C21.2 C20.2 11.11,33.34 IC3.GND 13.34,33.02 14.61,34.29 14.61,35.56 15.65,36.61 LED1.C 19.17,36.61 C30.- 19.39,35.52 C31.- | X3.3 61.91,7.3 C15.2 | C16.2 53.02,7.3 X4.3 | C14.2 73.97,8.57 72.39,6.99 X2.3 71.44,7.3 C24.2 | R15.1 35.77,7.2 X6.3 | R17.1 26.67,7.83 X7.3 | R19.1 17.78,7.83 X8.3 | C28.2 8.62,14.61 7.98,15.24
  Top 1.016: X1.M4 8.26,16.14 8.26,18.41 | C17.2 35.24,7.3 X6.3 | C18.2 26.36,7.3 X7.3 | C19.2 14.29,4.12 15.24,5.08 15.24,6.35 15.88,6.99 X8.3
  Top 1.27: X9.4 7.98,10.44 7.98,15.24 X1.M4
  Top 1.422: X11.1 3.81,30.3 3.81,24.77
  Top 1.676: X1.M3 3.81,24.77 X1.M2 X1.M1 X1.M4
  Bottom 0.406: v46.99,25.4 v44.45,25.4
  Bottom 0.61: SV1.10 27.94,30.48 28.57,29.84 37.47,29.84 38.1,30.48 SV1.2
  Bottom 0.813: IC3.GND 7.62,33.02 5.08,30.48 X11.1 | v45.72,17.78 47.62,15.88 47.62,6.99 | SV3.6 46.99,27.94 v46.99,25.4
  Bottom 1.016: X8.3 X7.3 X6.3 X5.3 47.62,6.99 X4.3 X3.3 X2.3 | S2.4 S2.3 | S1.3 S1.4
  Bottom 1.27: X8.3 14.93,6.99 12.38,9.53 X9.4
N$1
  Top 0.305: 18.05,23.12 IC2.11
  Top 0.406: IC1.13 38.23,24.79 37.94,25.08 35.4,25.08 32.86,22.54 18.63,22.54 18.05,23.12
N$2  (via drill 0.6)
  Top 0.305: 18.7,16.79 IC2.19
  Top 0.406: v18.1,16.19 18.7,16.79 | v24.13,16.19 27.62,16.19 29.84,18.41 29.84,21.11 30.48,21.75 33.18,21.75 35.72,24.29 37.47,24.29 37.76,23.99 IC1.14
  Bottom 0.406: v18.1,16.19 v24.13,16.19
N$3  (via drill 0.6, 0.6 pad 0.61)
  Top 0.406: IC2.3 23.25,27.69 24.13,28.57 v31.11,28.57 | IC1.15 36.82,23.19 v36.83,23.18
  Bottom 0.406: v31.11,28.57 31.59,28.57 36.83,23.34 v36.83,23.18
N$4
  Top 0.406: X3.2 64.14,4.45 64.77,5.08 64.77,7.62 63.82,8.57 60.81,8.57 Q2.3 59.47,9.92 C2.2
  Top 0.813: R5.2 65.62,4.45 X3.2
N$5
  Top 0.406: IC1.8 43.5,27.4 43.5,30 43.18,30.32 41.75,30.32 41.59,30.48 41.59,34.28 U$1.P$3 42.62,35.47 C8.2
N$6
  Top 0.406: U$1.P$1 44.3,31.51 C7.2 44.28,31.34 IC1.7
N$7
  Top 0.406: IC2.14 16.09,26.87 R25.2
N$8
  Top 0.406: C3.2 55.02,9.92 Q3.3 55.88,9.06 55.88,5.08 55.24,4.45
  Top 0.813: R7.2 56.3,3.39 55.24,4.45 X4.2
N$9
  Top 0.406: C1.2 65.18,9.92 Q1.3 66.5,9.7 67.94,8.26 67.94,5.71 69.22,4.45 X2.2
  Top 0.813: X2.2 71.33,4.66 R3.2
N$10
  Top 0.406: Q4.3 50.8,10.16 49.92,9.29 C4.2 48.66,9.29 46.99,7.62 46.99,5.08 46.35,4.45
  Top 0.813: R9.2 47.41,3.39 46.35,4.45 X5.2
N$11
  Top 0.61: X10.1 75.62,25.77 U$2.P$13
N$12
  Top 0.813: R14.1 38.95,1.69 38.1,2.54 38.1,3.81 37.47,4.45 X6.2
N$13
  Top 0.813: R16.1 30.06,1.69 29.21,2.54 29.21,3.17 27.94,4.45 X7.2
N$14  (via drill 0.6)
  Top 0.406: v43.02,17.62 43.48,17.16 IC1.26 | LED2.C 38.73,15.24 v39.37,15.88
  Bottom 0.406: v39.37,15.88 41.27,15.88 v43.02,17.62
N$15
  Top 0.305: IC2.1 24.55,24.35
  Top 0.406: IC1.9 42.69,29.39 42.55,29.53 37.62,29.53 32.23,24.13 24.77,24.13 24.55,24.35
N$16
  Top 0.305: IC2.5 21.95,23.77
  Top 0.406: IC1.10 41.88,28.6 41.75,28.73 37.94,28.73 32.54,23.34 22.38,23.34 21.95,23.77
N$17
  Top 0.406: IC1.25 42.69,14.74 42.23,14.29 36.29,14.29 LED3.C
N$18
  Top 0.406: LED3.A 31.65,13.34 R21.2
N$19
  Top 0.406: LED2.A 31.65,15.24 R22.2
N$20
  Top 0.813: R18.1 21.17,1.69 20.32,2.54 20.32,3.17 19.05,4.45 X8.2
N$21
  Top 0.813: R23.2 LED1.A
N$22
  Top 0.406: X9.1 10.79,1.91 11.43,2.54 11.43,4.45 15.88,8.89 16.75,8.89 C5.2 20.25,11.19 Q5.3
  Top 1.016: R11.2 X9.1
N$23
  Top 0.406: C6.2 9.92,11.67 12.53,9.06 12.7,9.06 | 12.7,9.06 Q6.3 | X9.2 10.16,4.45 12.7,6.99 12.7,9.06
  Top 1.016: R13.2 X9.2
N$39  (via drill 0.6)
  Top 0.305: IC2.20 19.34,16.54 C13.2
  Top 0.406: L1.1 14.8,16.95 v15.24,16.51 16.67,15.08 19.21,15.08 C13.2 | v19.05,27.3 R25.1
  Top 0.61: L1.1 13.06,16.88
  Bottom 0.813: v15.24,16.51 15.56,16.83 15.56,23.81 18,26.25 18,27.3 | 18,27.3 ZW2.2 | 18,27.3 v19.05,27.3
N$43
  Top 0.406: X1.1 9.86,21.92 10.16,22.23
  Top 0.61: 10.16,22.23 10.79,22.23 | 10.79,22.23 C29.2 | 10.79,22.23 11.99,22.23 L1.2
N$44
  Top 0.305: 16.51,19.68 16.75,19.45 IC2.16
  Top 0.406: X1.2 10.63,21.12 12.06,19.68 16.51,19.68
N$45
  Top 0.305: 15.64,18.41 IC2.15
  Top 0.406: 15.64,18.41 12.06,18.41 10.16,20.32 X1.3
N$46
  Top 0.305: IC2.17 17.39,20.07
  Top 0.406: 17.39,20.07 16.83,20.64 16.19,20.64 13.34,23.5 C11.1
NINT/VDI
  Top 0.406: IC1.42 57.01,23.99 58.42,25.4 58.42,29.21 58.98,29.77 U$2.P$1
NIRQ  (via drill 0.6)
  Top 0.406: v43.18,24.13 41.09,26.23 IC1.11
  Bottom 0.406: U$2.P$7 43.55,23.77 v43.18,24.13
NRES
  Top 0.406: IC1.41 56.19,23.19 58.42,20.95 58.42,20.32 59.05,19.68 59.87,19.68 U$2.P$11
NSEL  (via drill 0.6)
  Top 0.406: IC1.44 51.44,26.14 v51.44,26.67 R24.2
  Bottom 0.406: U$2.P$5 59.04,26.67 v51.44,26.67
PA1
  Top 0.406: IC1.36 52.56,19.19 56.04,15.72 60.48,15.72 61.59,14.61 62.23,14.61 63.34,13.49 R2.2 64.45,13.39 Q1.2 63.41,11.89 C1.1
PA2
  Top 0.406: IC1.35 52.09,18.39 55.56,14.92 57.78,14.92 58.84,13.87 R4.2 58.74,13.55 Q2.2 57.69,11.89 C2.1
PA3
  Top 0.406: IC1.34 51.62,17.59 54.4,14.82 R6.2 54.4,11.99 Q3.2 53.25,11.89 C3.1
PA4
  Top 0.406: 49.09,15.24 49.09,14.41 Q4.2 49.37,13.16 C4.1 | 49.09,15.24 IC1.33 | R8.2 49.09,15.24
PA5
  Top 0.406: IC1.32 48.26,15.77 48.26,10.16 46.67,8.57 42.23,8.57 41.91,8.26 41.91,6.35 41.06,5.5 R15.2
  Top 0.813: R14.2 R15.2
PA6
  Top 0.406: IC1.31 47.48,10.5 46.51,9.53 40.96,9.53 40.01,8.57 30.27,8.57 30.06,8.79 | R16.2 30.9,3.39 29.53,4.76 29.53,8.26 30.06,8.79 | 30.06,8.79 R17.2
PA7
  Top 0.406: IC1.30 46.69,11.12 46.04,10.48 40.32,10.48 39.37,9.53 32.38,9.53 31.11,10.79 27.3,10.79 25.3,8.79 21.17,8.79 | R18.2 22.01,3.39 20.64,4.76 20.64,8.26 21.17,8.79 | 21.17,8.79 R19.2
RGND  (1 unrouted)
  pour Top (isolate 0.61, no thermals): 77.47,20.32 73.03,20.32 70.48,22.86 70.48,27.94 73.03,30.48 77.47,30.48
  pour Bottom (isolate 0.61, no thermals): 77.47,20.32 73.03,20.32 70.48,22.86 70.48,27.94 73.03,30.48 77.47,30.48
RST  (via drill 0.6)
  Top 0.406: 34.29,31.75 34.29,35.72 v33.02,36.99 | IC1.4 46.69,29.54 47.62,30.48 48.26,30.48 48.79,31.01 R20.1 | S2.1 32.03,26.67 33.66,26.67 34.29,27.3 34.29,31.75 | 34.29,31.75 SV1.6
  Top 0.813: SV3.5 48.79,32.28 R20.1
  Bottom 0.406: v33.02,36.99 34.13,38.1 48.9,38.1 50.8,36.2 SV3.5
  Bottom 1.016: S2.2 S2.1
SCK
  Top 0.406: IC1.3 47.48,29.07 47.94,29.53 51.12,29.53 52.07,30.48 52.07,33.02 SV3.3
  Bottom 0.305: U$2.P$4 60.95,28.77 58.61,28.77
  Bottom 0.406: SV3.3 54.61,33.02 54.61,30 55.85,28.77 58.61,28.77
SCL  (via drill 0.6, 0.6 pad 0.41)
  Top 0.406: IC1.19 39.27,20 37.47,20 v37.15,19.68 | v27.3,13.65 26.57,12.91 R10.2 25.3,13.02 Q5.2 23,13.34 19.45,13.34 C5.1
  Bottom 0.406: v37.15,19.68 38.1,18.73 38.1,15.88 35.88,13.65 v27.3,13.65
SDA  (via drill 0.6, 0.6 pad 0.41)
  Top 0.406: IC1.20 38.08,19.19 37.31,18.41 v36.83,18.41 | C6.1 12.47,11.26 Q6.2 13.02,11.75 v13.97,12.7 16.09,12.7 R12.2
  Bottom 0.406: v36.83,18.41 36.83,15.88 35.56,14.61 15.88,14.61 v13.97,12.7
SDI
  Top 0.406: IC1.1 49.17,27.3 50.48,27.3 53.34,30.16 SV3.4
  Bottom 0.406: SV3.4 53.34,28.57 54.15,27.77 U$2.P$3
SDO  (via drill 0.6)
  Top 0.406: IC1.2 48.28,28.44 48.58,28.73 50.16,28.73 v50.32,28.57
  Bottom 0.406: v50.32,28.57 50.8,28.57 52.07,29.84 52.07,35.56 52.7,36.2 53.98,36.2 SV3.1 62.87,34.29 63.5,33.66 63.5,26.67 62.59,25.77 U$2.P$6
TCK  (via drill 0.6)
  Top 0.406: SV1.1 R29.1 | IC1.21 38.39,18.39 37.15,17.14 35.88,17.14 v35.56,17.46
  Bottom 0.406: SV1.1 39.37,34.29 39.37,23.34 35.56,19.53 v35.56,17.46
TDI  (via drill 0.6)
  Top 0.406: SV1.9 R26.1 | IC1.24 41.91,15.81 41.91,18.41 v42.55,19.05
  Bottom 0.406: SV1.9 29.53,35.88 33.97,35.88 34.92,36.83 40.27,36.83 41.27,35.82 41.27,21.59 42.55,20.32 v42.55,19.05
TDO  (via drill 0.6)
  Top 0.406: SV1.3 R28.1 | IC1.23 41.09,19.5 v41.27,19.68
  Bottom 0.406: v41.27,19.68 40.32,20.64 40.32,35.24 39.69,35.88 36.2,35.88 35.56,35.24 SV1.3
TMS  (via drill 0.6)
  Top 0.406: v33.02,28.57 31.75,29.84 31.75,33.02 SV1.5 33.02,34.71 R27.1 | IC1.22 39.18,17.59 37.94,16.35 34.77,16.35 v34.29,16.83
  Bottom 0.406: v34.29,16.83 34.29,19.21 37.78,22.7 37.78,23.81 v33.02,28.57
USR_SW  (via drill 0.6)
  Top 0.406: IC1.40 48.11,22.39 v47.62,21.91 | R1.1 68.58,16.71 S1.1
  Bottom 0.406: v47.62,21.91 56.83,21.91 57.78,20.95 57.78,19.05 58.42,18.41 67.51,18.41 68.93,17 S1.1
  Bottom 1.016: S1.1 S1.2